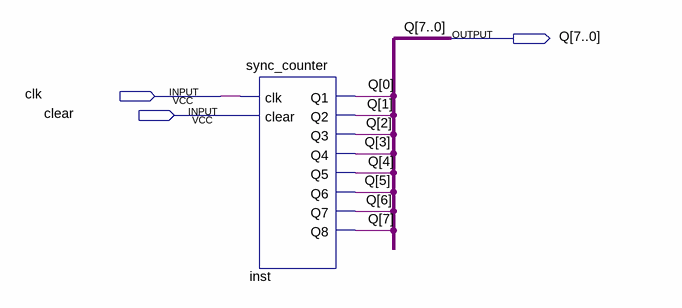
[diagram p0: schematic sheet]
// Quartus schematic sync_counter_bus.bdf as structural Verilog: 1 symbols, 3 pins
module sync_counter_bus (
  input  clk,
  input  clear,
  output [7:0] Q
);

  sync_counter inst (
    .clk(clk), .clear(clear), .Q1(Q[0]), .Q2(Q[1]), .Q3(Q[2]), .Q4(Q[3]), .Q5(Q[4]), .Q6(Q[5]), .Q7(Q[6]),
    .Q8(Q[7]));
endmodule
